# EAGLE design sonda2 (EAGLE 4.16)
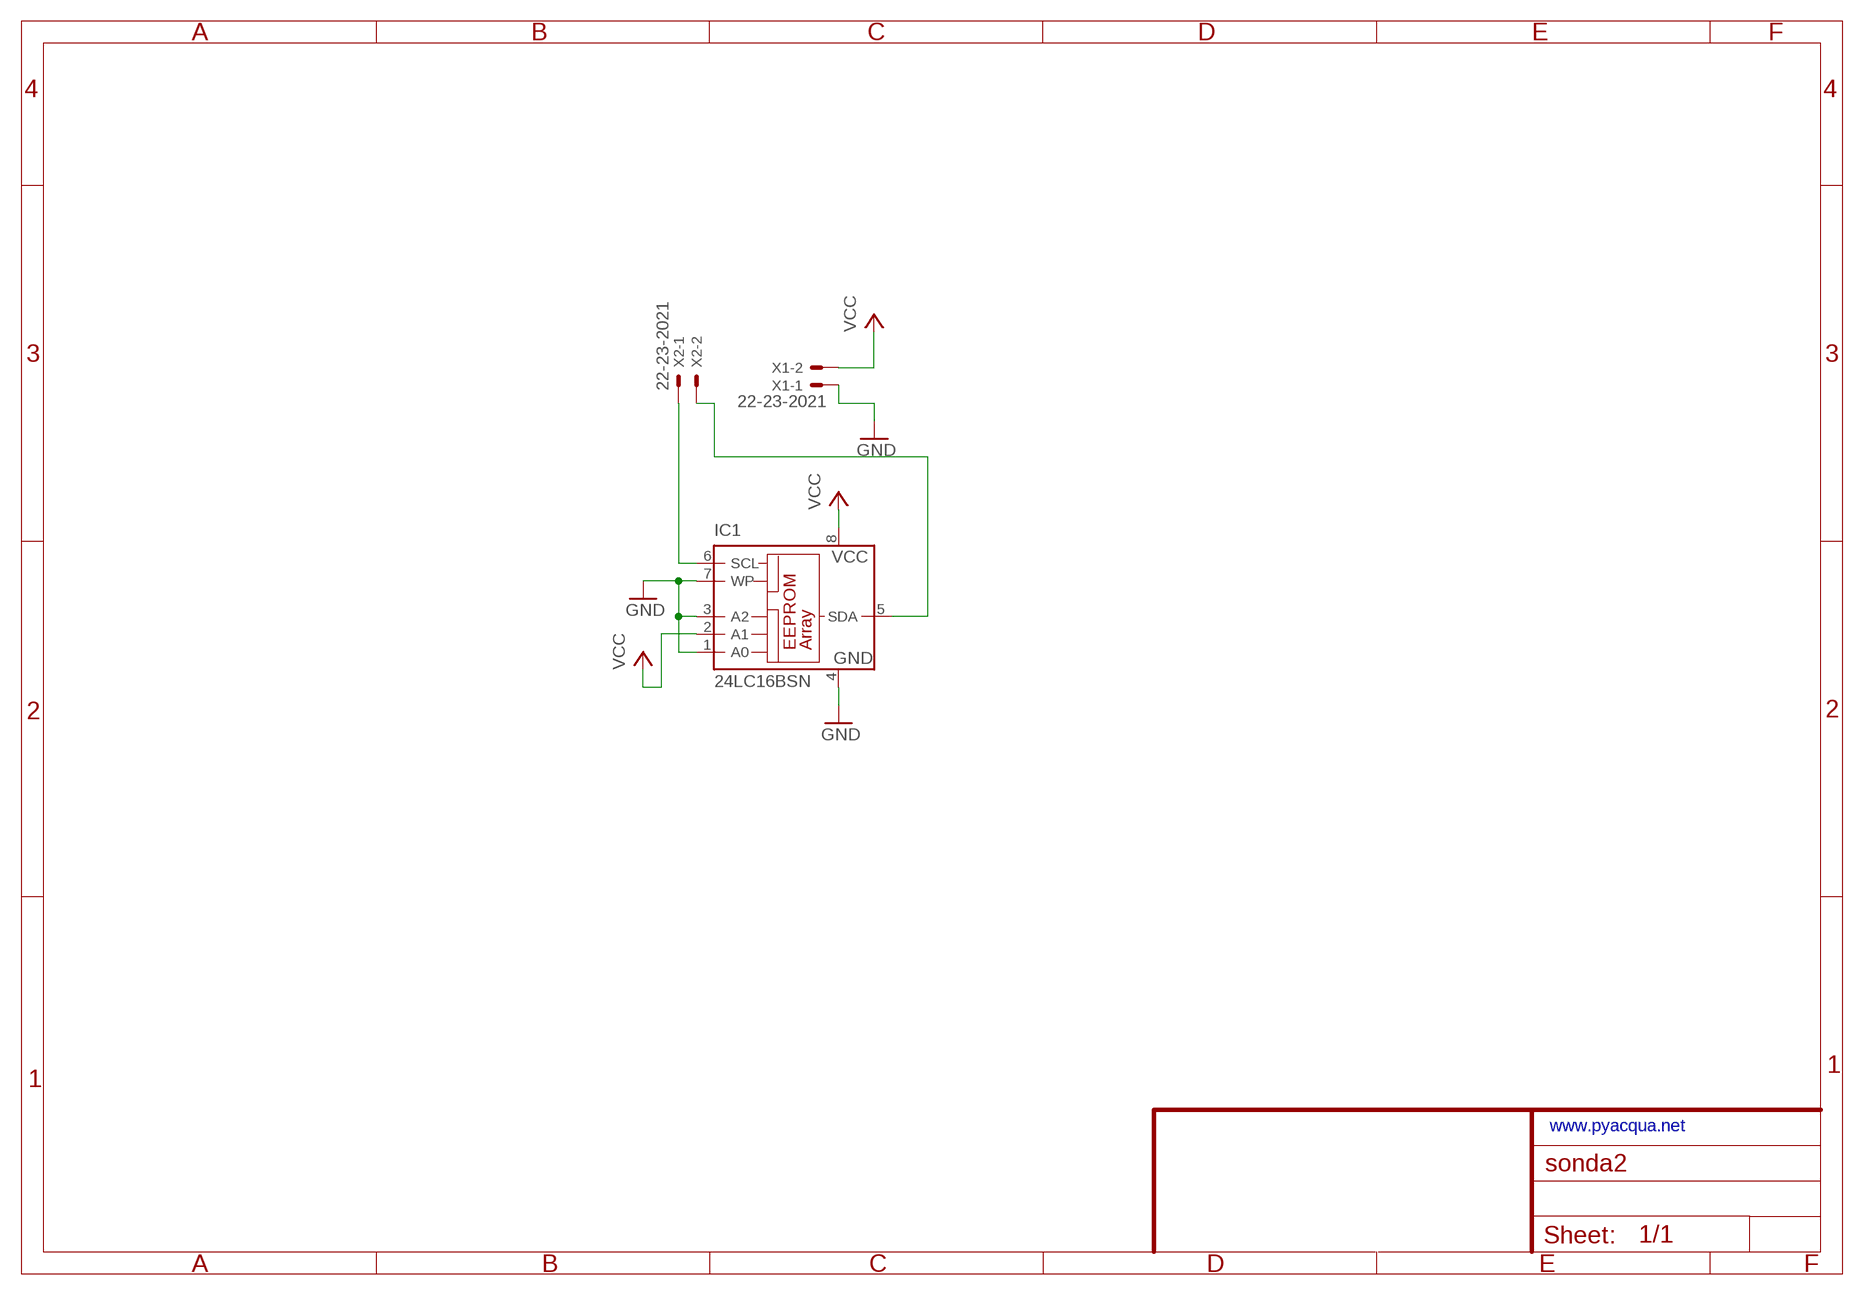
[diagram p0: schematic, sheet 1]

## Parts
IC1  24LC16BSN  [SO-08]
X1  22-23-2021  [22-23-2021]
X2  22-23-2021  [22-23-2021]

## Nets
GND: IC1.1(A0) IC1.3(A2) IC1.4(GND) IC1.7(WP) X1.1
N$1: IC1.6(SCL) X2.1
N$2: IC1.5(SDA) X2.2
VCC: IC1.2(A1) IC1.8(VCC) X1.2

## Notes on the sheet
- www.pyacqua.net

## Library data of the parts
IC1 = microchip:24*: Serial EEPROM I2C
X1 X2 = con-molex:22-23-2021: .100" (2.54mm) Center Header - 2 Pin

## Board
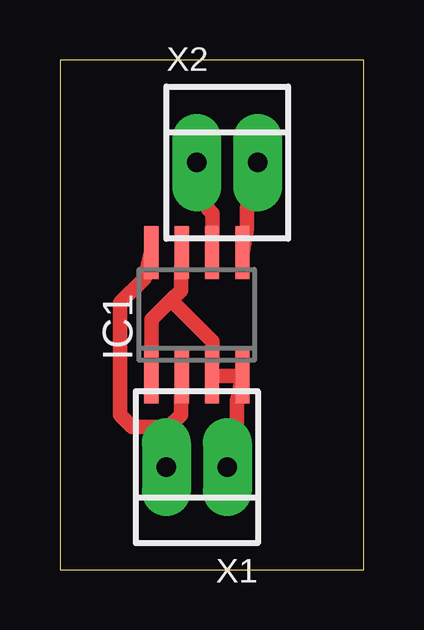
[diagram p1: board, top side]

Size 12.68 x 21.26 mm. Coordinates in mm from the lower left corner, seen from the top.
Outline: 0,0 12.68,0 12.68,21.26 0,21.26 0,0
Copper layers (1*16): Top 0.035mm / dielectric 1.5mm / Bottom 0.035mm
Design rules "mio2": minimum track width 24mil, minimum drill 24mil, track to track 24mil, track to pad 24mil, pad to pad 24mil, via to via 24mil, smd to smd 24mil, copper to edge 40mil, drill to drill 8mil, minimum pad ring 24mil, minimum via ring 24mil, stop-mask expansion 4mil, vias tented up to drill 0mil, thermal gap 10mil

### Footprints (pad centres in the part's own frame; a part is rotated, then mirrored left to right if it is on the bottom)
SO-08 = smd 0.6 x 2.2: 1 -1.905,-2.6; 2 -0.635,-2.6; 3 0.635,-2.6; 4 1.905,-2.6; 5 1.905,2.6; 6 0.635,2.6; 7 -0.635,2.6; 8 -1.905,2.6
22-23-2021 = drill 0.813 long: 1 -1.27,0; 2 1.27,0

### Placement (x,y rotation side)
IC1  5.71,10.63 0 top
U$1  [A4P-LOC]  -45.09,-106.21 0 top  (outside the outline)
X1  5.71,4.28 180 top
X2  6.98,16.98 0 top

### Tracks (layer width: path | path; a pad name or v marks a point on that pad's centre or on a via)
GND
  Top 0.61: 4.64,11.24 5.05,11.65 5.05,12.15 IC1.7 | 4.64,11.24 3.83,10.43 3.83,9.11 IC1.1 | 4.64,11.24 6.37,9.51 6.37,9.11 IC1.3 6.57,8.09 7.39,8.09 IC1.4 7.39,7.02 7.39,6.21 X1.1
N$1
  Top 0.61: IC1.6 6.37,14.24 6.37,14.85 6.17,15.05 X2.1
N$2
  Top 0.61: IC1.5 7.79,14.24 7.79,15.05 X2.2
VCC
  Top 0.61: 4.44,5.96 3.02,5.96 2.51,6.46 2.51,11.14 3.53,12.15 IC1.8 | 4.44,5.96 4.54,5.96 5.05,6.46 5.05,6.97 IC1.2 | 4.44,5.96 X1.2

### Text on the board
Pads: www.pyacqua.net